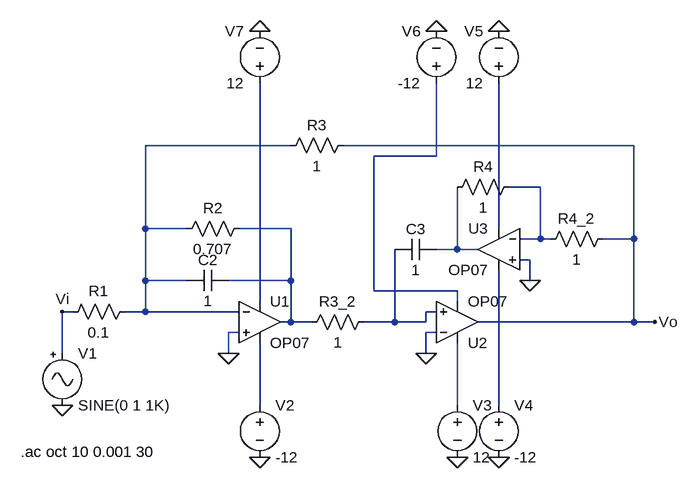
[diagram p0: schematic TS2.asc]
TS2.asc, the LTspice schematic file:
Version 4
SHEET 1 972 680
WIRE 368 64 144 64
WIRE 896 64 448 64
WIRE 592 80 592 -32
WIRE 592 80 496 80
WIRE 752 128 704 128
WIRE 144 192 144 64
WIRE 208 192 144 192
WIRE 368 192 288 192
WIRE 688 192 688 -32
WIRE 752 208 752 128
WIRE 752 208 720 208
WIRE 768 208 752 208
WIRE 896 208 896 64
WIRE 896 208 848 208
WIRE 624 224 624 128
WIRE 624 224 592 224
WIRE 656 224 624 224
WIRE 736 240 720 240
WIRE 144 272 144 192
WIRE 208 272 144 272
WIRE 368 272 368 192
WIRE 368 272 272 272
WIRE 736 272 736 240
WIRE 496 288 496 80
WIRE 624 288 496 288
WIRE 320 304 320 -32
WIRE 624 304 624 288
WIRE 32 320 16 320
WIRE 144 320 144 272
WIRE 144 320 112 320
WIRE 288 320 144 320
WIRE 592 320 576 320
WIRE 368 336 368 272
WIRE 368 336 352 336
WIRE 400 336 368 336
WIRE 528 336 528 224
WIRE 528 336 480 336
WIRE 576 336 576 320
WIRE 576 336 528 336
WIRE 896 336 896 208
WIRE 896 336 656 336
WIRE 928 336 896 336
WIRE 288 352 272 352
WIRE 592 352 576 352
WIRE 16 384 16 320
WIRE 272 384 272 352
WIRE 576 384 576 352
WIRE 320 464 320 368
WIRE 624 464 624 368
WIRE 688 464 688 256
FLAG 272 384 0
FLAG 576 384 0
FLAG 736 272 0
FLAG 16 464 0
FLAG 320 -112 0
FLAG 592 -112 0
FLAG 688 -112 0
FLAG 688 544 0
FLAG 624 544 0
FLAG 320 544 0
FLAG 928 336 Vo
FLAG 16 320 Vi
SYMBOL OpAmps/OP07 320 272 R0
SYMATTR InstName U1
SYMBOL OpAmps/OP07 624 400 M180
SYMATTR InstName U2
SYMBOL res 304 176 R90
WINDOW 0 0 56 VBottom 2
WINDOW 3 32 56 VTop 2
SYMATTR InstName R2
SYMATTR Value 0.707
SYMBOL res 720 112 R90
WINDOW 0 0 56 VBottom 2
WINDOW 3 32 56 VTop 2
SYMATTR InstName R4
SYMATTR Value 1
SYMBOL res 464 48 R90
WINDOW 0 0 56 VBottom 2
WINDOW 3 32 56 VTop 2
SYMATTR InstName R3
SYMATTR Value 1
SYMBOL res 128 304 R90
WINDOW 0 0 56 VBottom 2
WINDOW 3 32 56 VTop 2
SYMATTR InstName R1
SYMATTR Value 0.1
SYMBOL cap 272 256 R90
WINDOW 0 0 32 VBottom 2
WINDOW 3 32 32 VTop 2
SYMATTR InstName C2
SYMATTR Value 1
SYMBOL cap 592 208 R90
WINDOW 0 0 32 VBottom 2
WINDOW 3 32 32 VTop 2
SYMATTR InstName C3
SYMATTR Value 1
SYMBOL res 496 320 R90
WINDOW 0 0 56 VBottom 2
WINDOW 3 32 56 VTop 2
SYMATTR InstName R3_2
SYMATTR Value 1
SYMBOL res 864 192 R90
WINDOW 0 0 56 VBottom 2
WINDOW 3 32 56 VTop 2
SYMATTR InstName R4_2
SYMATTR Value 1
SYMBOL OpAmps/OP07 688 160 M0
SYMATTR InstName U3
SYMBOL Misc/signal 16 368 R0
SYMATTR InstName V1
SYMATTR Value2 AC 1
SYMBOL voltage 320 448 R0
SYMATTR InstName V2
SYMATTR Value -12
SYMBOL voltage 624 448 R0
SYMATTR InstName V3
SYMATTR Value 12
SYMBOL voltage 688 448 R0
SYMATTR InstName V4
SYMATTR Value -12
SYMBOL voltage 688 -16 R180
WINDOW 0 24 96 Left 2
WINDOW 3 24 16 Left 2
SYMATTR InstName V5
SYMATTR Value 12
SYMBOL voltage 592 -16 R180
WINDOW 0 24 96 Left 2
WINDOW 3 24 16 Left 2
SYMATTR InstName V6
SYMATTR Value -12
SYMBOL voltage 320 -16 R180
WINDOW 0 24 96 Left 2
WINDOW 3 24 16 Left 2
SYMATTR InstName V7
SYMATTR Value 12
TEXT -48 536 Left 2 !.ac oct 10 0.001 30

The netlist it stands for:
* TS2.asc
XU1 0 N001 N007 N009 N004 LT1001  ; OP07, pins In+ In- V+ V- OUT
XU2 N008 0 N010 N002 Vo LT1001  ; OP07, pins In+ In- V+ V- OUT
R2 N004 N001 0.707
R4 N003 N006 1
R3 Vo N001 1
R1 N001 Vi 0.1
C2 N004 N001 1
C3 N006 N008 1
R3_2 N008 N004 1
R4_2 Vo N003 1
XU3 0 N003 N005 N011 N006 LT1001  ; OP07, pins In+ In- V+ V- OUT
V1 Vi 0 SINE(0 1 1K) AC 1
V2 N009 0 -12
V3 N010 0 12
V4 N011 0 -12
V5 N005 0 12
V6 N002 0 -12
V7 N007 0 12
.ac oct 10 0.001 30
.lib LTC.lib
.backanno
.end